# Altium schematic sheet SH10 - RS-485.SchDoc: RS-485
size B; CheckedBy: Lance Bantoto; DrawnBy: Cindy Li; Engineer: Cindy Li; Organization: UW Robotics; Address1: 200 University Avenue; Address2: Waterloo; Address3: Ontario; Address4: Canada N2L 3G6; DocumentNumber: 10; Revision: 2; SheetNumber: 10; SheetTotal: 10
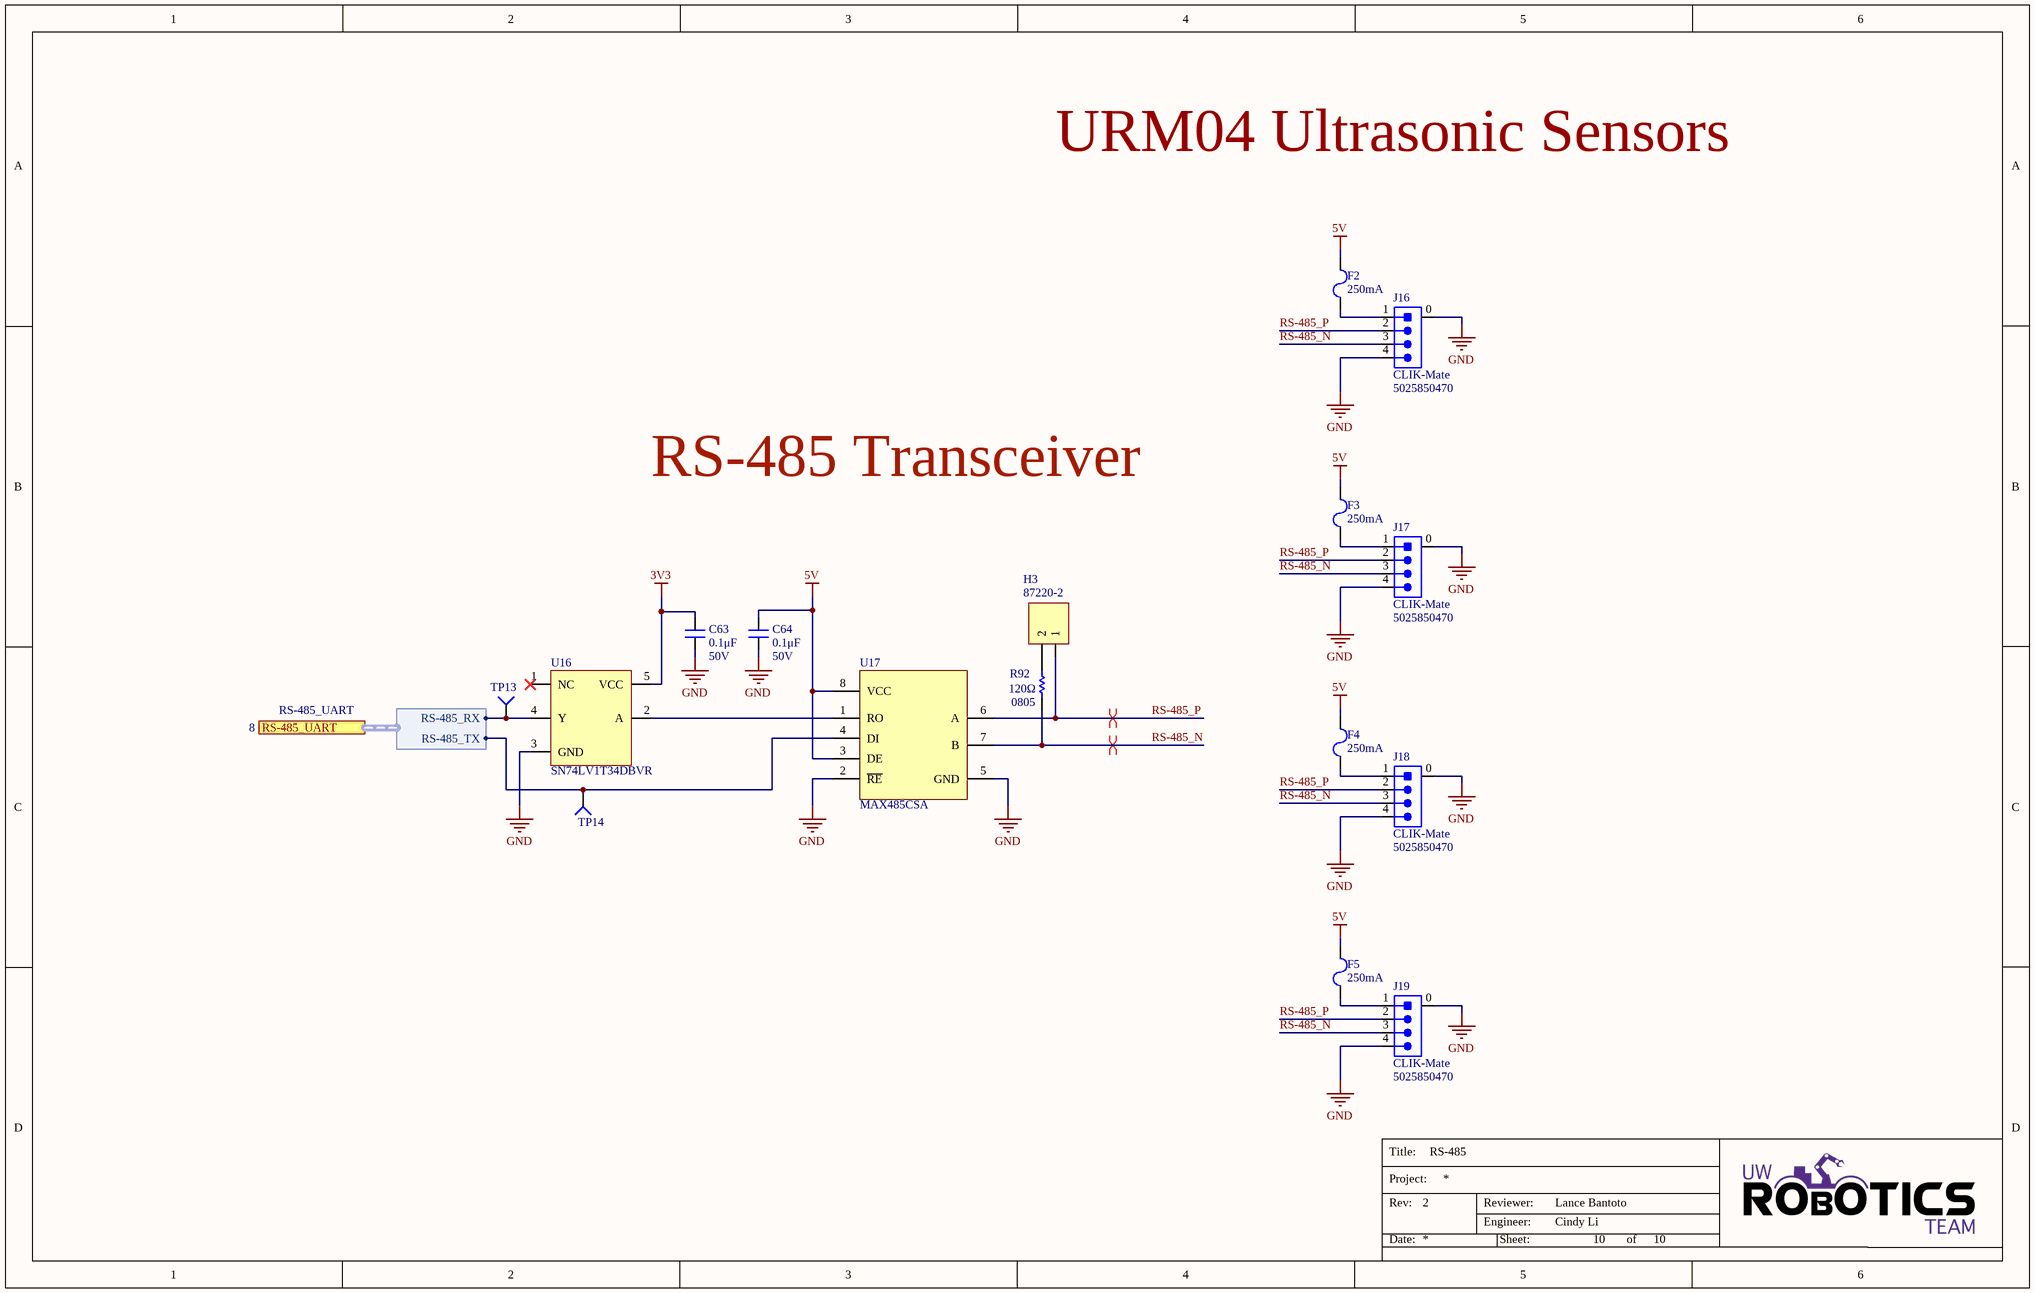
[diagram p0: SH10 - RS-485.SchDoc]

## Parts
C63  value 0.1μF  Voltage Rating: 50V  [CAP2012]  (hidden comment: CAP_0.1uF_50V_0805)
C64  value 0.1μF  Voltage Rating: 50V  [CAP2012]  (hidden comment: CAP_0.1uF_50V_0805)
F2  Current Rating: 250mA  [FUSE_1206]  (hidden comment: FUSE_250mA_1206)
F3  Current Rating: 250mA  [FUSE_1206]  (hidden comment: FUSE_250mA_1206)
F4  Current Rating: 250mA  [FUSE_1206]  (hidden comment: FUSE_250mA_1206)
F5  Current Rating: 250mA  [FUSE_1206]  (hidden comment: FUSE_250mA_1206)
H3  Manufacturer Part Number 1: 87220-2  [HDR1X2]  (hidden comment: JUMPER_2)
J16  Family: CLIK-Mate  Manufactor Number: 5025850470  [MOLEX-5025850470]  (hidden comment: CON_4M_SM_RA)
J17  Family: CLIK-Mate  Manufactor Number: 5025850470  [MOLEX-5025850470]  (hidden comment: CON_4M_SM_RA)
J18  Family: CLIK-Mate  Manufactor Number: 5025850470  [MOLEX-5025850470]  (hidden comment: CON_4M_SM_RA)
J19  Family: CLIK-Mate  Manufactor Number: 5025850470  [MOLEX-5025850470]  (hidden comment: CON_4M_SM_RA)
R92  Resistance: 120Ω  Package/Footprint: 0805  [RESC0805]  (hidden comment: RES_120Ω_0805_1%)
TP13  TESTPOINT_1MM_CIRCLE  [TESTPOINT_CIRCLE_1MM]  (value not drawn)  (no BOM)
TP14  TESTPOINT_1MM_CIRCLE  [TESTPOINT_CIRCLE_1MM]  (value not drawn)  (no BOM)
U16  SN74LV1T34  [SN74LV1T34DBVR]  (value not drawn)
U17  MAX485CSA  [SOIC127P600X175-8N]

## Ports
RS-485_UART (harness RS-485_UART, see 8)

## Harnesses
RS-485_UART: RS-485_RX, RS-485_TX

## Nets
3V3: C63.1 U16.5(VCC)
5V: C64.1 F2.2 F3.2 F4.2 F5.2 U17.3(DE) U17.8(VCC)
GND: C63.2 C64.2 J16.0 J16.4 J17.0 J17.4 J18.0 J18.4 J19.0 J19.4 U16.3(GND) U17.2(~{RE}) U17.5(GND)
RS-485_N: J16.3 J17.3 J18.3 J19.3 R92.1 U17.7(B)
RS-485_P: H3.1 J16.2 J17.2 J18.2 J19.2 U17.6(A)
NetF2_1: F2.1 J16.1
NetF3_1: F3.1 J17.1
NetF4_1: F4.1 J18.1
NetF5_1: F5.1 J19.1
NetH3_2: H3.2 R92.2
NetTP13_1: TP13.1(=value) U16.4(Y) ; port RS-485_UART.RS-485_RX
NetTP14_1: TP14.1(=value) U17.4(DI) ; port RS-485_UART.RS-485_TX
NetU16_2: U16.2(A) U17.1(RO)

Not connected (* = marked no-connect by the designer): U16 1(NC)*

## Layout directives
differential pair: RS-485_N, RS-485_P

## Notes on the sheet
- URM04 Ultrasonic Sensors
- RS-485 Transceiver
- Title:
- Project:
- Date:
- Rev:
- Reviewer:
- Engineer:
- Sheet:
- of

## Library data of the parts
C63 C64 = CAP_0.1uF_50V_0805: CAP CER 0.1UF 50V X7R 0805; Manufacturer Part Number 1: GCM21BR71H104KA37K; Manufacturer 1: Murata Electronics; Tolerance: 10%; Package/Footprint: 0805; Supplier Part Number 1: 490-8049-1-ND; Supplier 1: Digi-Key; Mount: Surface Mount; Dielectric: X7R; Length: 2mm; Height: 1.25mm; Width: 0.049inch; Thickness: 0.049inch; Depth: 1.25mm; Ratings: AEC-Q200; LCSC Part #: C49678; Mounting Type: SMD
F2-F5 = FUSE_250mA_1206: FUSE BOARD MNT 250MA 125VAC/VDC; Manufacturer 1: Littelfuse; Manufacturer Part Number 1: 0466.250NR; DC Cold Resistance: 31mR; Power Dissipation: 157.5mW; Approvals: UL,CSA; Working Voltage: 250V; Package/Footprint: 1206; Supplier 1: Digi-Key; Supplier Part Number 1: F1452CT-ND; Current: 250mA; Length: 3.18mm; Height: 0.023inch; Width: 0.06inch; Depth: 1.52mm; Mounting Type: SMD
H3 = JUMPER_2: HEADER 2X1; Manufacturer 1: TE Connectivity; Package/Footprint: TH; Supplier 1: Digi-Key; Supplier Part Number 1: A26542-ND; Mount: Through Hole; Mounting Type: TH
J16-J19 = CON_4M_SM_RA: CONN HEADER SMD RIGHT ANGLE 1.5 MM PITCH; Manufacturer: Molex; Supplier 1: Digi-Key; Supplier Part Number 1: WM9449CT-ND; Package/Footprint: SMD; Mounting Type: SMD
R92 = RES_120Ω_0805_1%: RES 120 OHM 1% 1/8W 0805; Manufacturer 1: Vishay; Manufacturer Part Number 1: CRCW0805120RFKEA; Supplier Part Number 1: 541-120CCT-ND; Supplier 1: Digi-Key; LCSC Part #: C17437; Mounting Type: SMD
TP13 TP14 = TESTPOINT_1MM_CIRCLE: TESTPOINT 1MM CIRCLE; Part Number (MPN): *
U16 = SN74LV1T34: IC BUF NON-INVERT 5.5V SOT23-5; Manufacturer 1: Texas Instruments; Package/Footprint: SOT-23-5; Supplier 1: Digi-Key; Supplier Part Number 1: 296-37176-1-ND; Manufacturer Part Number 1: SN74LV1T34DBVR; LCSC Part #: C100024; Mounting Type: SMD
U17 = MAX485CSA: IC TRANSCEIVER HALF 1/1 8SOIC RS422, RS485; Manufacturer 1: Maxim Integrated; Manufacturer Part Number 1: MAX485CSA+T; Data Rate: 2.5Mbps; Supply Voltage: 4.75V - 5.25V; Package/Footprint: 8-SOIC; Supplier 1: Digi-Key; Supplier Part Number 1: MAX485CSA+TCT-ND; Protocol: RS422, RS485; Mounting Type: SMD; LCSC Part #: C9945